# Altium schematic sheet 充电二板-1.SchDoc
size A4
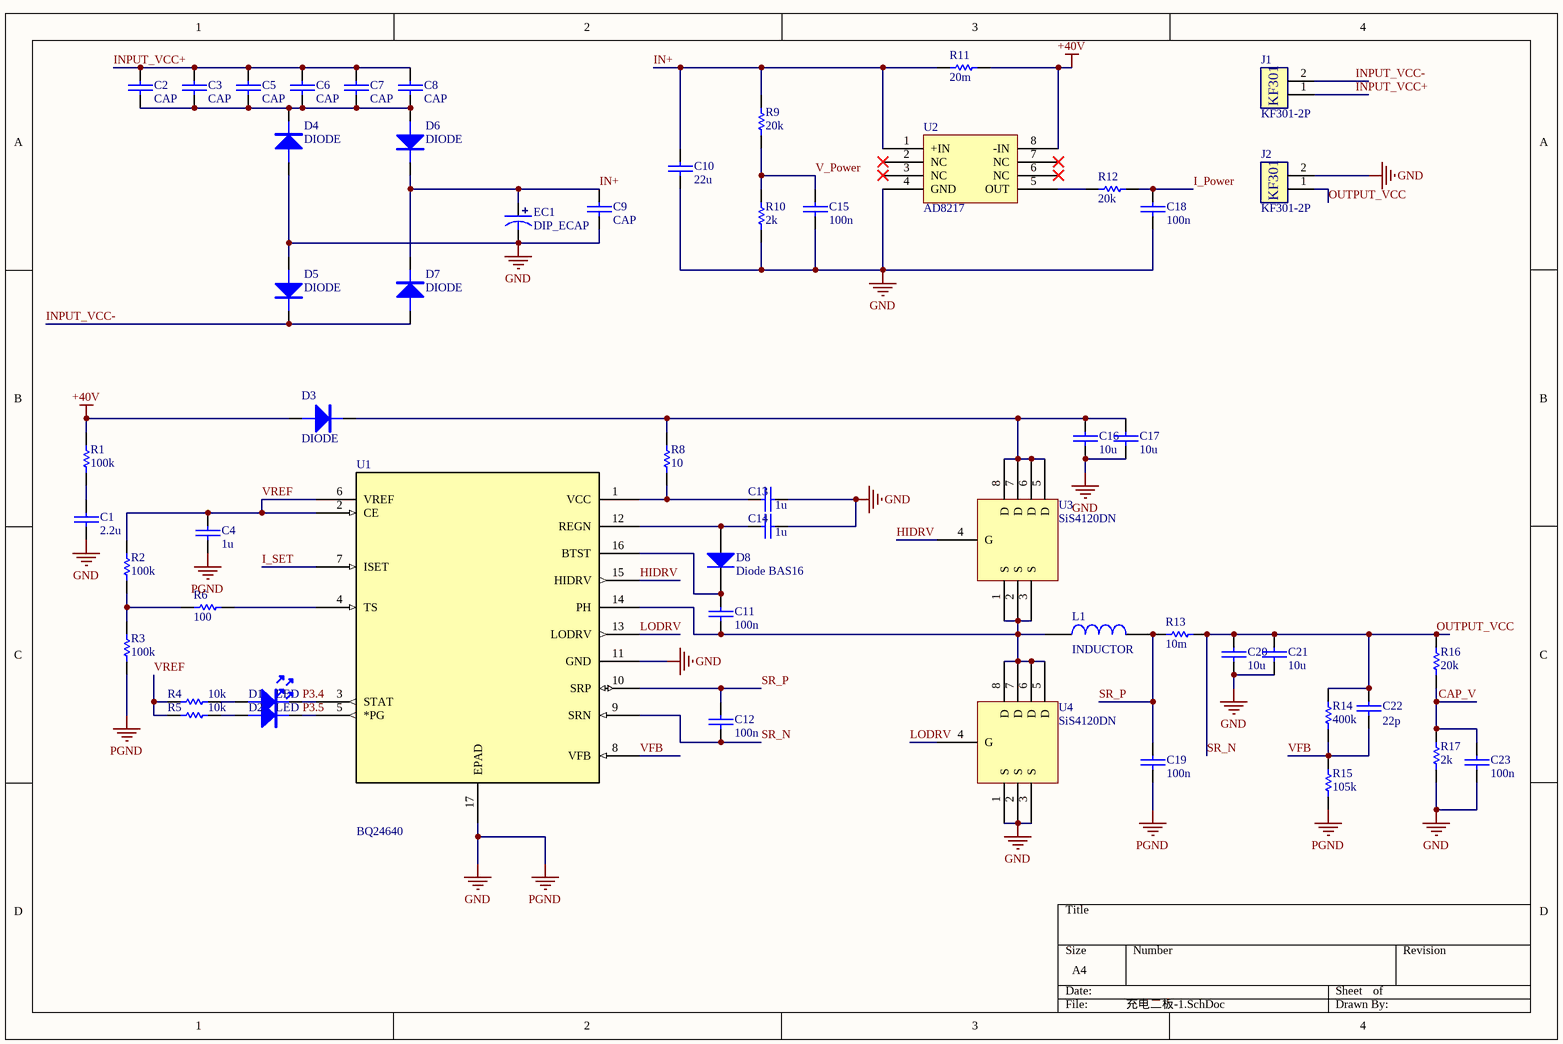
[diagram p0: 充电二板-1.SchDoc]

## Parts
C1  2.2u  [0603C]
C2  CAP  [1206C]
C3  CAP  [1206C]
C4  1u  [0603C]
C5  CAP  [1206C]
C6  CAP  [1206C]
C7  CAP  [1206C]
C8  CAP  [1206C]
C9  CAP  [1206C]
C10  22u  [1206C]
C11  100n  [0603C]
C12  100n  [0603C]
C13  1u  [0603C]
C14  1u  [0603C]
C15  100n  [0603C]
C16  10u  [1206C]
C17  10u  [1206C]
C18  100n  [0603C]
C19  100n  [0603C]
C20  10u  [1206C]
C21  10u  [1206C]
C22  22p  [0603C]
C23  100n  [0603C]
D1  LED  [LED-0603W]
D2  LED  [LED-0603W]
D3  DIODE  [SMA/DO-214AC]
D4  DIODE  [SMA/DO-214AC]
D5  DIODE  [SMA/DO-214AC]
D6  DIODE  [SMA/DO-214AC]
D7  DIODE  [SMA/DO-214AC]
D8  Diode BAS16  [SOT-23_N]
EC1  DIP_ECAP  [DIP-EC3.5X8X11.5]
J1  KF301-2P  [KF301-5.0-2P]
J2  KF301-2P  [KF301-5.0-2P]
L1  INDUCTOR  [CDRH73]
R1  100k  [0603R]
R2  100k  [0603R]
R3  100k  [0603R]
R4  10k  [0603R]
R5  10k  [0603R]
R6  100  [0603R]
R8  10  [0603R]
R9  20k  [0603R]
R10  2k  [0603R]
R11  20m  [2512R]
R12  20k  [0603R]
R13  10m  [2512R]
R14  400k  [0603R]
R15  105k  [0603R]
R16  20k  [0603R]
R17  2k  [0603R]
U1  BQ24640  [BQ24640]
U2  AD8217  [AD8127]
U3  SiS4120DN  [SiS412DN]
U4  SiS4120DN  [SiS412DN]

## Nets
+40V: D3.A R1.2 R11.1 U2.8(-IN)
GND: C1.1 C4.1 C9.1 C10.1 C13.1 C14.1 C15.1 C16.1 C17.1 C18.1 C19.1 C20.1 C21.1 C23.1 D4.A D5.A EC1.2 J2.2 R3.1 R10.1 R15.1 R17.1 U1.11(GND) U1.17(EPAD) U2.4(GND) U4.1(S) U4.2(S) U4.3(S)  [also labelled PGND]
CAP_V: C23.2 R16.1 R17.2
HIDRV: U1.15(HIDRV) U3.4(G)
I_Power: C18.2 R12.1
I_SET: U1.7(ISET)
IN+: C9.2 C10.2 D6.K D7.K EC1.1 R9.2 R11.2 U2.1(+IN)
INPUT_VCC+: C2.2 C3.2 C5.2 C6.2 C7.2 C8.2 J1.1
INPUT_VCC-: D5.K D7.A J1.2
LODRV: U1.13(LODRV) U4.4(G)
OUTPUT_VCC: C12.2 C20.2 C21.2 C22.2 J2.1 R13.1 R14.2 R16.2 U1.9(SRN)  [also labelled SR_N]
P3.4: D1.K U1.3(STAT)
P3.5: D2.K U1.5(*PG)
SR_P: C12.1 C19.2 L1.2 R13.2 U1.10(SRP)
V_Power: C15.2 R9.1 R10.2
VFB: C22.1 R14.1 R15.2 U1.8(VFB)
VREF: C4.2 R2.2 R4.2 R5.2 U1.2(CE) U1.6(VREF)
NetC1_2: C1.2 R1.1
NetC2_1: C2.1 C3.1 C5.1 C6.1 C7.1 C8.1 D4.K D6.A
NetC11_1: C11.1 D8.3(K) U1.16(BTST)
NetC11_2: C11.2 L1.1 U1.14(PH) U3.1(S) U3.2(S) U3.3(S) U4.5(D) U4.6(D) U4.7(D) U4.8(D)
NetC13_2: C13.2 R8.2 U1.1(VCC)
NetC14_2: C14.2 D8.1(A) U1.12(REGN)
NetC16_2: C16.2 C17.2 D3.K R8.1 U3.5(D) U3.6(D) U3.7(D) U3.8(D)
NetD1_A: D1.A R4.1
NetD2_A: D2.A R5.1
NetR2_1: R2.1 R3.2 R6.2
NetR6_1: R6.1 U1.4(TS)
NetR12_2: R12.2 U2.5(OUT)

Not connected (* = marked no-connect by the designer): U2 2(NC)* 3(NC)* 6(NC)* 7(NC)*

## Notes on the sheet
- (in symbol KF301-2P) KF301

## Library data of the parts
C1-C23 = CAP: 无极性电容
D3-D7 = DIODE: 普通二极管
D8 = Diode BAS16: Silicon Switching Diode for High-Speed Switching; Note: Pin 2 is not connected and not drawn.; Published: 21-Mar-2003; LatestRevisionDate: 29-May-2009; LatestRevisionNote: IPC-7351 Footprint Added.; DatasheetVersion: Oct-1999; PackageVersion: Sep-2001; PackageReference: SOT-23; Publisher: Altium Limited; PackageDescription: 3-Pin SOT-23 Package 0.95 mm Pitch, 2.5 mm Lead Span; ComponentLink1Description: Manufacturer Link; ComponentLink1URL: http://www.infineon.com/; ComponentLink2Description: Datasheet; ComponentLink2URL: http://www.infineon.com/upload/Document/cmc_upload/documents/012/5331/bas16series.pdf
EC1 = DIP_ECAP: 直插电解电容
R1-R6 R8-R17 = RES